# EAGLE design mainboard (EAGLE 8.0.2)
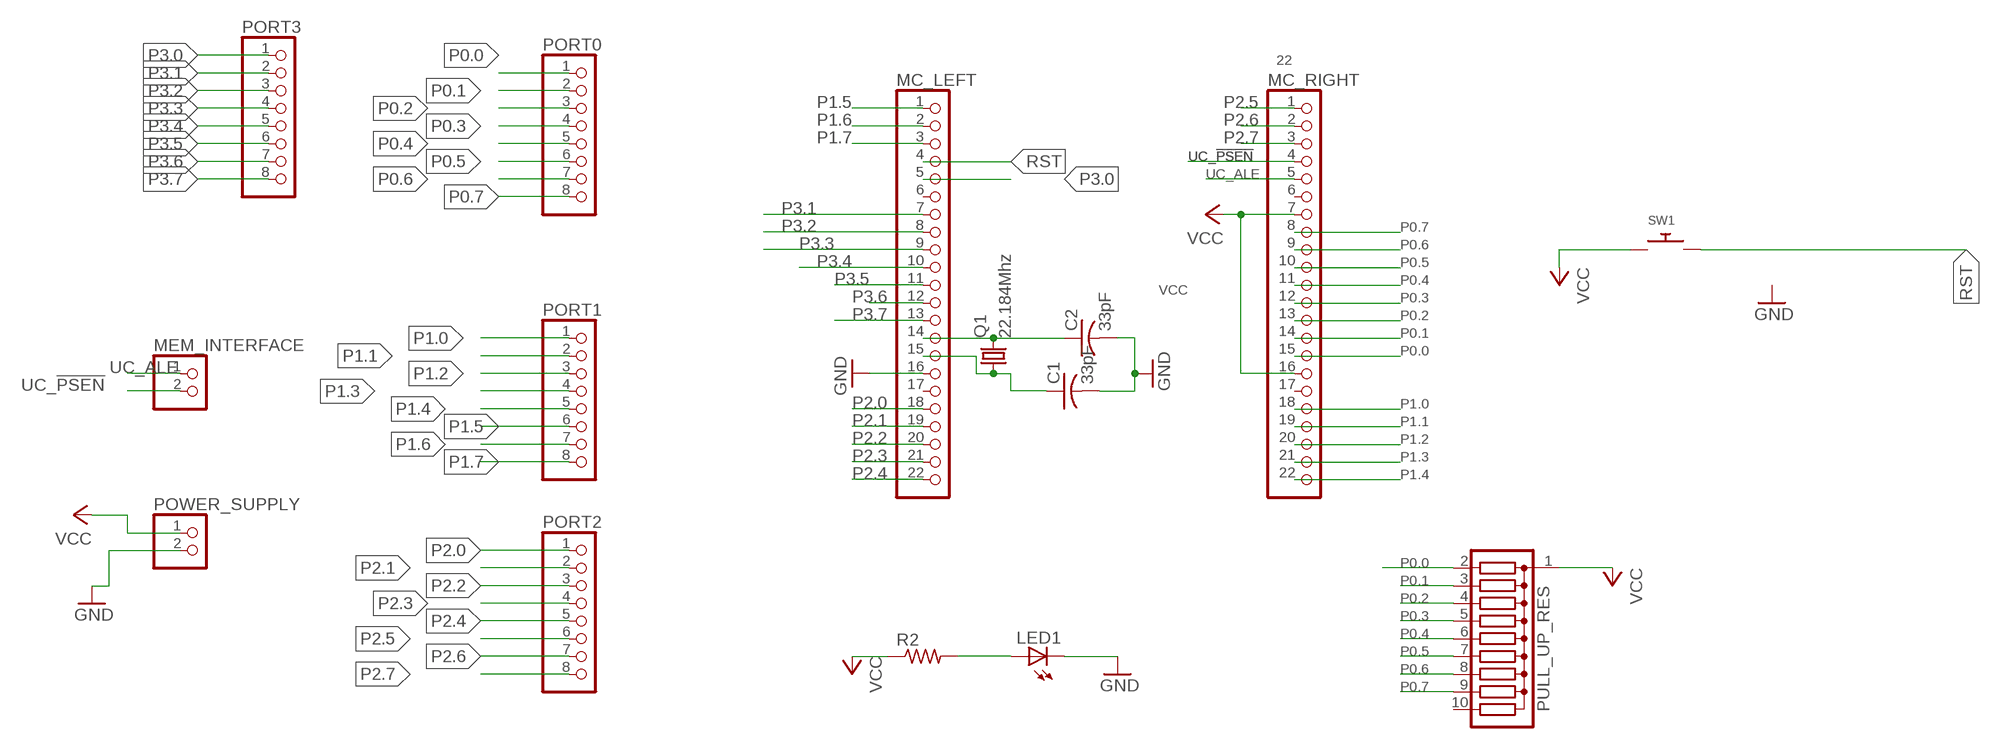
[diagram p0: schematic, sheet 1]

## Parts
C1  33pF  C-US050-025X075  [C050-025X075]
C2  33pF  C-US050-025X075  [C050-025X075]
LED1  LED3MM  [LED3MM]
MC_LEFT  PINHD-1X22  [1X22]
MC_RIGHT  PINHD-1X22  [1X22]
MEM_INTERFACE  PINHD-1X2  [1X02]
PORT0  PINHD-1X8  [1X08]
PORT1  PINHD-1X8  [1X08]
PORT2  PINHD-1X8  [1X08]
PORT3  PINHD-1X8  [1X08]
POWER_SUPPLY  PINHD-1X2  [1X02]
PULL_UP_RES  G09R  [SIL10]
Q1  22.184Mhz  CRYSTALHC49S  [HC49/S]
R2  R-US_0204/5  [0204/5]
SW1  SWITCH_PUSHBUTTONEVQ-PE  [TACT_PANA-EVQ]

## Nets
GND: C1.2 C2.2 LED1.K(C) MC_LEFT.16 POWER_SUPPLY.2
N$1: C2.1 MC_LEFT.14 Q1.2
N$2: C1.1 MC_LEFT.15 Q1.1
N$12: LED1.A R2.2
P0.0: MC_RIGHT.15 PORT0.1 PULL_UP_RES.2
P0.1: MC_RIGHT.14 PORT0.2 PULL_UP_RES.3
P0.2: MC_RIGHT.13 PORT0.3 PULL_UP_RES.4
P0.3: MC_RIGHT.12 PORT0.4 PULL_UP_RES.5
P0.4: MC_RIGHT.11 PORT0.5 PULL_UP_RES.6
P0.5: MC_RIGHT.10 PORT0.6 PULL_UP_RES.7
P0.6: MC_RIGHT.9 PORT0.7 PULL_UP_RES.8
P0.7: MC_RIGHT.8 PORT0.8 PULL_UP_RES.9
P1.0: MC_RIGHT.18 PORT1.1
P1.1: MC_RIGHT.19 PORT1.2
P1.2: MC_RIGHT.20 PORT1.3
P1.3: MC_RIGHT.21 PORT1.4
P1.4: MC_RIGHT.22 PORT1.5
P1.5: MC_LEFT.1 PORT1.6
P1.6: MC_LEFT.2 PORT1.7
P1.7: MC_LEFT.3 PORT1.8
P2.0: MC_LEFT.18 PORT2.1
P2.1: MC_LEFT.19 PORT2.2
P2.2: MC_LEFT.20 PORT2.3
P2.3: MC_LEFT.21 PORT2.4
P2.4: MC_LEFT.22 PORT2.5
P2.5: MC_RIGHT.1 PORT2.6
P2.6: MC_RIGHT.2 PORT2.7
P2.7: MC_RIGHT.3 PORT2.8
P3.0: MC_LEFT.5 PORT3.1
P3.1: MC_LEFT.7 PORT3.2
P3.2: MC_LEFT.8 PORT3.3
P3.3: MC_LEFT.9 PORT3.4
P3.4: MC_LEFT.10 PORT3.5
P3.5: MC_LEFT.11 PORT3.6
P3.6: MC_LEFT.12 PORT3.7
P3.7: MC_LEFT.13 PORT3.8
RST: MC_LEFT.4 SW1.P$2
UC_!PSEN: MC_RIGHT.4 MEM_INTERFACE.2
UC_ALE: MC_RIGHT.5 MEM_INTERFACE.1
VCC: MC_RIGHT.7 MC_RIGHT.16 POWER_SUPPLY.1 PULL_UP_RES.1 R2.1 SW1.P$1
Unconnected: MC_LEFT.6 MC_LEFT.17 MC_RIGHT.6 MC_RIGHT.17 PULL_UP_RES.10

## Notes on the sheet
- 22

## Library data of the parts
C1 C2 = adafruit:C-US: CAPACITOR, American symbol
LED1 = adafruit:LED: LED OSRAM: - CHIPLED LG R971, LG N971, LY N971, LG Q971, LY Q971, LO R971, LY R971 LH N974, LH R974 LS Q976, LO Q976, LY Q976 LO Q996 - Hyper CHIPLED LW Q18S LB Q993, LB Q99A, LB R99A - SideLED LS A670, LO A670, LY A670, LG A670, LP A670 LB A673, LV A673, LT A673, LW A673 LH A674 LY A675 LS A676, LA A676, LO A676, LY A676, LW A676 LS A679, LY A679, LG A679 - Hyper Micro SIDELED® LS Y876, LA Y876, LO Y876, LY Y876 LT Y87S - SmartLED LW L88C, LW L88S LB L89C, LB L89S, LG L890 LS L89K, LO L89K, LY L89K LS L896, LA L896, LO L896, LY L896 - TOPLED LS T670, LO T670, LY T670, LG T670, LP T670 LSG T670, LSP T670, LSY T670, LOP T670, LYG T670 LG T671, LOG T671, LSG T671 LB T673, LV T673, LT T673, LW T673 LH T674 LS T676, LA T676, LO T676, LY T676, LB T676, LH T676, LSB T676, LW T676 LB T67C, LV T67C, LT T67C, LS T67K, LO T67K, LY T67K, LW E67C LS E67B, LA E67B, LO E67B, LY E67B, LB E67C, LV E67C, LT E67C LW T67C LS T679, LY T679, LG T679 LS T770, LO T770, LY T770, LG T770, LP T770 LB T773, LV T773, LT T773, LW T773 LH T774 LS E675, LA E675, LY E675, LS T675 LS T776, LA T776, LO T776, LY T776, LB T776 LHGB T686 LT T68C, LB T68C - Hyper Mini TOPLED® LB M676 - Mini TOPLED Santana® LG M470 LS M47K, LO M47K, LY M47K Source: http://www.osram.convergy.de/
MC_LEFT MC_RIGHT = pinhead:PINHD-1X22: PIN HEADER
MEM_INTERFACE POWER_SUPPLY = pinhead:PINHD-1X2: PIN HEADER
PORT0 PORT1-PORT3 = pinhead:PINHD-1X8: PIN HEADER
PULL_UP_RES = resistor-sil:G09R: SIL RESISTOR; OC_FARNELL: unknown; OC_NEWARK: unknown
Q1 = adafruit:CRYSTAL: CRYSTAL; OC_FARNELL: 1667008; OC_NEWARK: unknown
R2 = adafruit:R-US_: RESISTOR, American symbol
SW1 = adafruit:SWITCH_PUSHBUTTON: Buttons SOFTTOUCHSMD_SJ - Soft touch temporary push button (Super Junk Akihabara) Compatible with SKPMANE010 [Mouser: 688-SKPMAN] C&K_KSS = Digikey: KSS221GLFS

## Board
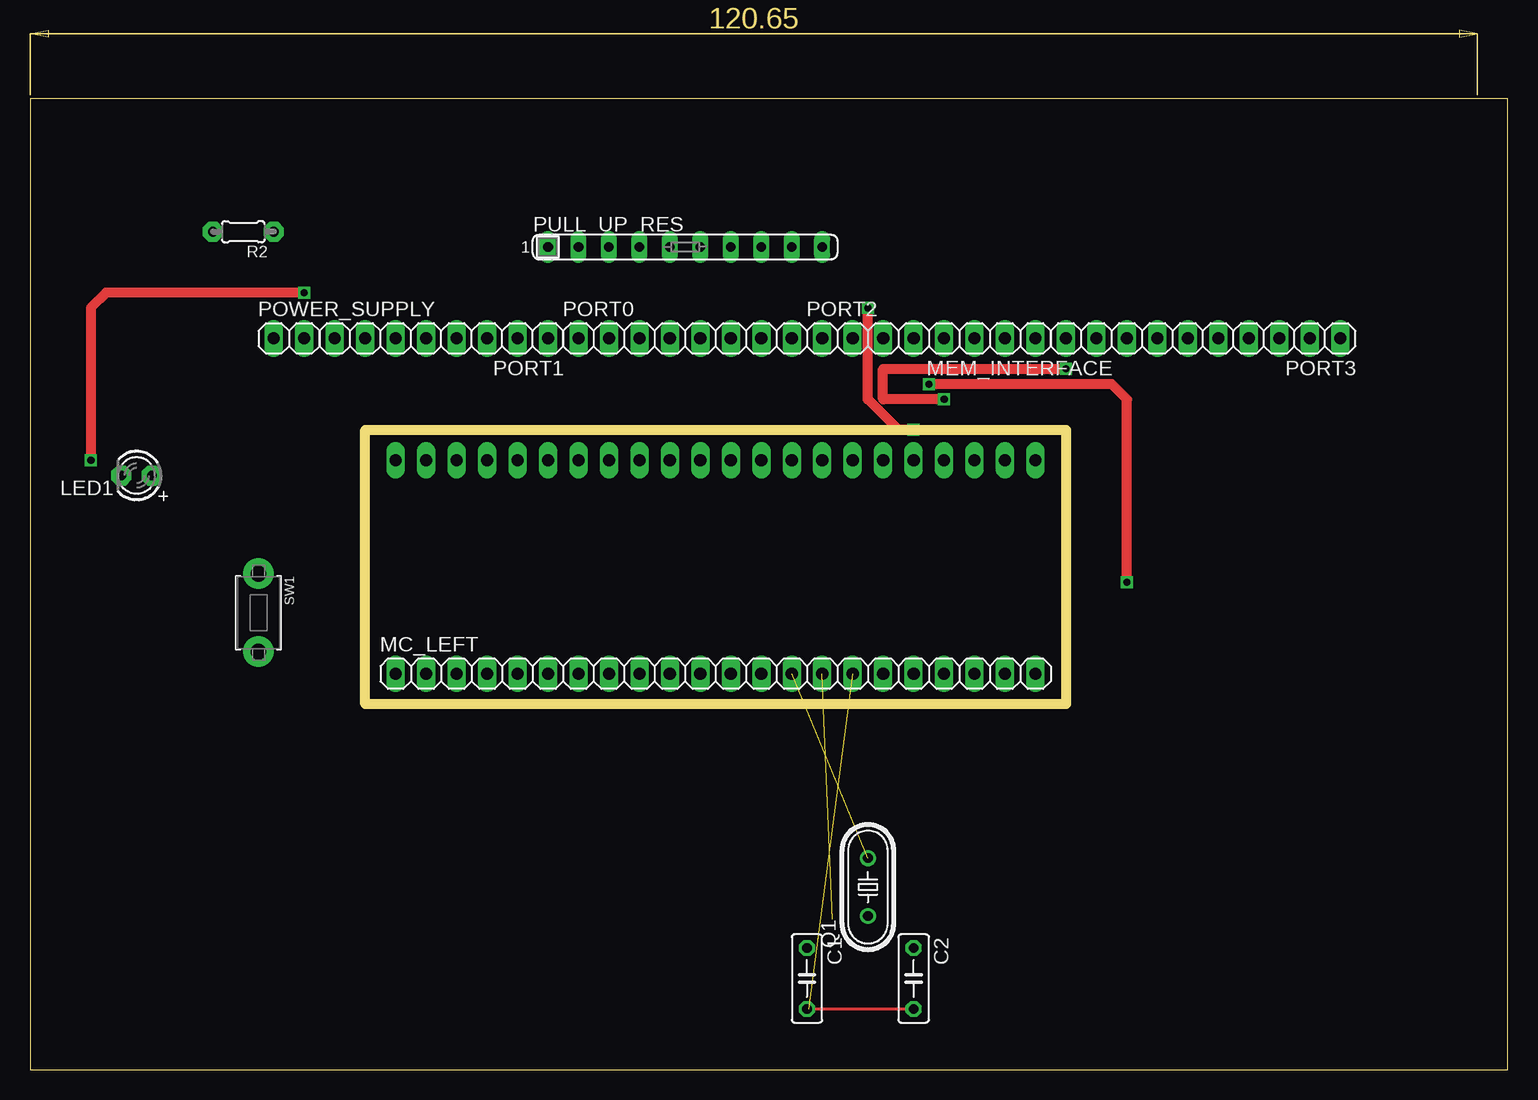
[diagram p1: board, top side]
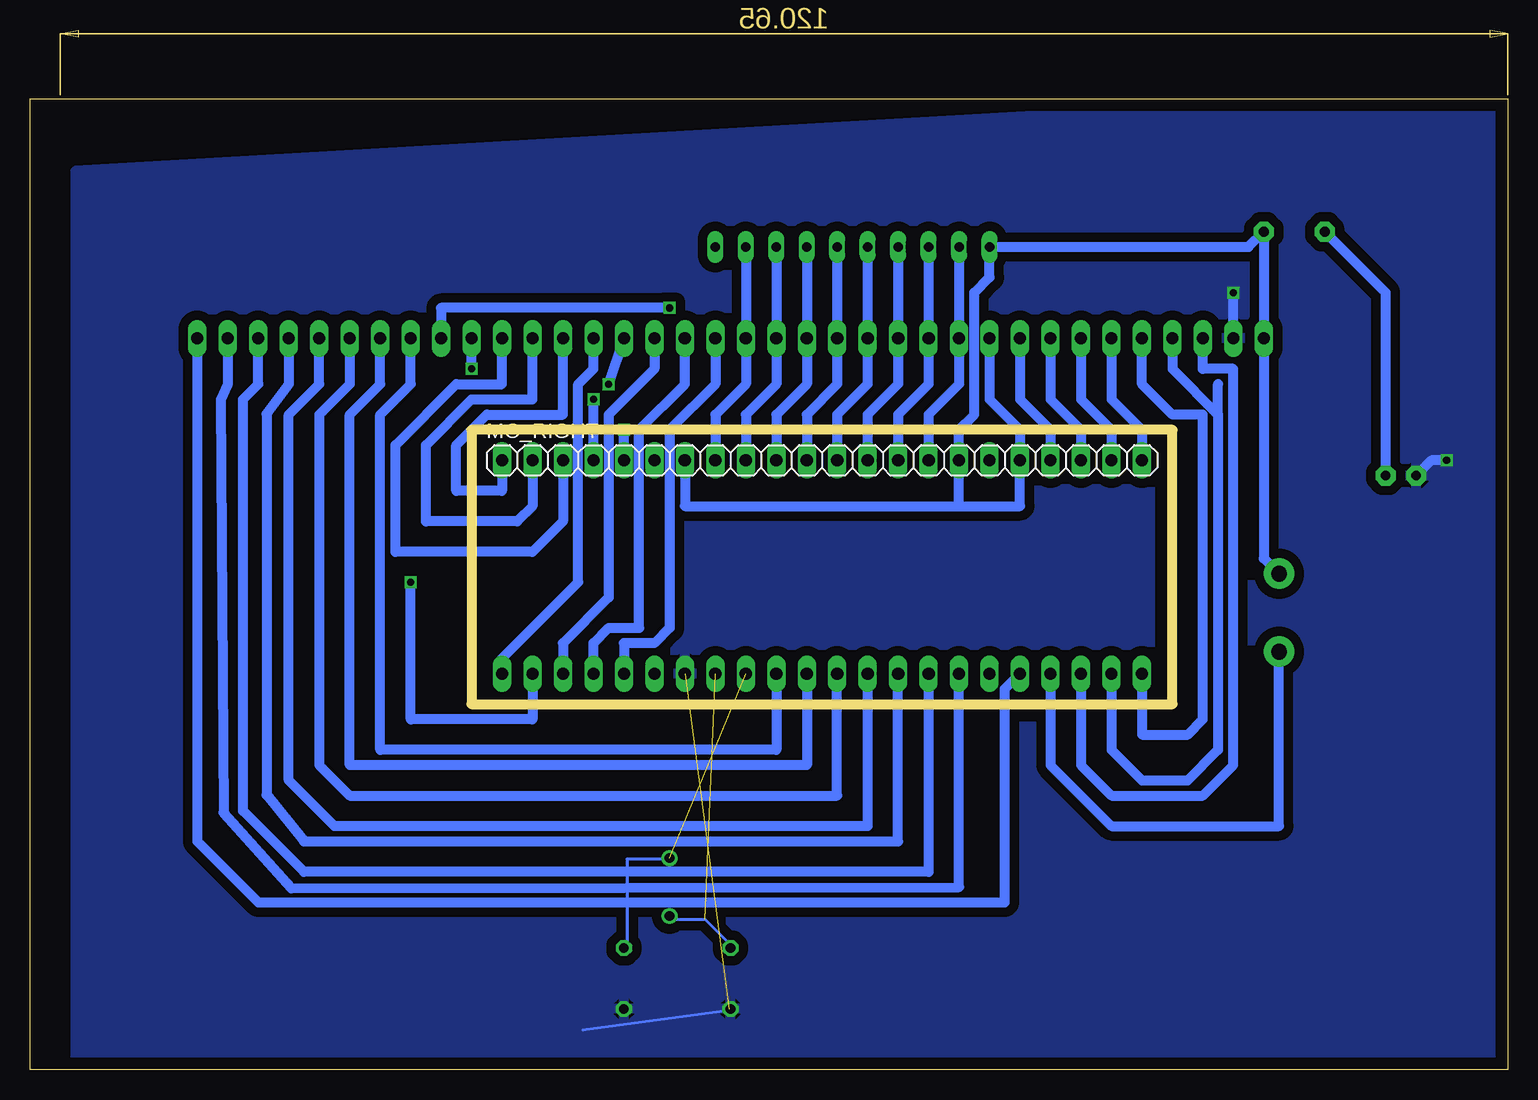
[diagram p2: board, bottom side, seen from below]

Size 123.17 x 80.95 mm. Coordinates in mm from the lower left corner, seen from the top.
Outline: 0,0 123.17,0 123.17,80.95 0,80.95 0,0
Outline: 27.94,53.34 86.36,53.34 86.36,30.48 27.94,30.48 27.94,53.34
Copper layers (1*16): Top 0.035mm / dielectric 1.5mm / Bottom 0.035mm
Design rules "default *": minimum track width 10mil, minimum drill 24mil, track to track 0.8mm, track to pad 1mm, pad to pad 8mil, via to via 8mil, smd to smd 8mil, copper to edge 40mil, drill to drill 8mil, minimum pad ring 10mil, minimum via ring 8mil, stop-mask expansion 4mil, vias tented up to drill 0mil, thermal gap 10mil

### Footprints (pad centres in the part's own frame; a part is rotated, then mirrored left to right if it is on the bottom)
C050-025X075 = drill 0.813 octagon: 1 -2.54,0; 2 2.54,0
LED3MM = drill 0.813 pad 1.676 octagon: A -1.27,0; K 1.27,0
1X22 = drill 1.016 long: 1 -26.67,0; 2 -24.13,0; 3 -21.59,0; 4 -19.05,0; 5 -16.51,0; 6 -13.97,0; 7 -11.43,0; 8 -8.89,0; 9 -6.35,0; 10 -3.81,0; 11 -1.27,0; 12 1.27,0; 13 3.81,0; 14 6.35,0; 15 8.89,0; 16 11.43,0; 17 13.97,0; 18 16.51,0; 19 19.05,0; 20 21.59,0; 21 24.13,0; 22 26.67,0
1X02 = drill 1.016 long: 1 -1.27,0; 2 1.27,0
1X08 = drill 1.016 long: 1 -8.89,0; 2 -6.35,0; 3 -3.81,0; 4 -1.27,0; 5 1.27,0; 6 3.81,0; 7 6.35,0; 8 8.89,0
SIL10 = drill 0.813 long: 1 -11.43,0; 2 -8.89,0; 3 -6.35,0; 4 -3.81,0; 5 -1.27,0; 6 1.27,0; 7 3.81,0; 8 6.35,0; 9 8.89,0; 10 11.43,0
HC49/S = drill 0.813: 1 -2.413,0; 2 2.413,0
0204/5 = drill 0.813 pad 1.676 octagon: 1 -2.54,0; 2 2.54,0
TACT_PANA-EVQ = drill 1.3 pad 2.54: P$1 -3.25,0; P$2 3.25,0

### Placement (x,y rotation side)
C1  64.77,7.62 270 top
C2  73.66,7.62 270 top
LED1  8.89,49.53 180 top
MC_LEFT  57.15,33.02 0 top
MC_RIGHT  57.15,50.8 0 bottom
MEM_INTERFACE  87.63,60.96 180 top
PORT0  54.61,60.96 0 top
PORT1  34.29,60.96 180 top
PORT2  74.93,60.96 0 top
PORT3  100.33,60.96 180 top
POWER_SUPPLY  21.59,60.96 0 top
PULL_UP_RES  54.61,68.58 0 top
Q1  69.85,15.24 90 top
R2  17.78,69.85 180 top
SW1  19.05,38.1 270 top

### Tracks (layer width: path | path; a pad name or v marks a point on that pad's centre or on a via)
GND  (via drill 0.6)  (1 unrouted)
  Top 0.254: C1.2 64.9,5.06 73.4,5.06 C2.2
  Top 0.813: v22.86,64.77 6.35,64.77 5.08,63.5 v5.08,50.8
  Bottom 0.254: 77.1,3.33 64.4,5.06 C1.2
  Bottom 0.813: POWER_SUPPLY.2 v22.86,64.77 | v5.08,50.8 6.35,50.8 LED1.K
  pour Bottom: 119.38,74.93 119.38,-3.81 -6.35,-3.81 -6.35,81.28 8.89,81.28
N$1  (1 unrouted)
  Bottom 0.254: C2.1 73.4,10.56 73.4,17.56 69.9,17.56 Q1.2
N$2  (1 unrouted)
  Bottom 0.254: C1.1 64.9,10.56 66.9,12.56 69.4,12.56 Q1.1
N$12
  Bottom 0.813: LED1.A 10.16,64.77 R2.2
P0.0
  Bottom 0.813: MC_RIGHT.15 48.26,54.61 45.72,57.15 PORT0.1 PULL_UP_RES.2
P0.1
  Bottom 0.813: MC_RIGHT.14 50.8,54.61 48.26,57.15 PORT0.2 PULL_UP_RES.3
P0.2
  Bottom 0.813: MC_RIGHT.13 53.34,54.61 50.8,57.15 PORT0.3 PULL_UP_RES.4
P0.3
  Bottom 0.813: MC_RIGHT.12 55.88,54.61 53.34,57.15 PORT0.4 PULL_UP_RES.5
P0.4
  Bottom 0.813: MC_RIGHT.11 58.42,54.61 55.88,57.15 PORT0.5 PULL_UP_RES.6
P0.5
  Bottom 0.813: MC_RIGHT.10 60.96,54.61 58.42,57.15 PORT0.6 PULL_UP_RES.7
P0.6
  Bottom 0.813: MC_RIGHT.9 63.5,54.61 60.96,57.15 PORT0.7 PULL_UP_RES.8
P0.7
  Bottom 0.813: MC_RIGHT.8 66.04,54.61 63.5,57.15 PORT0.8 PULL_UP_RES.9
P1.0
  Bottom 0.813: PORT1.1 43.18,55.88 40.64,53.34 MC_RIGHT.18
P1.1
  Bottom 0.813: PORT1.2 40.64,55.88 38.1,53.34 MC_RIGHT.19
P1.2
  Bottom 0.813: PORT1.3 38.1,55.88 35.56,53.34 MC_RIGHT.20
P1.3
  Bottom 0.813: PORT1.4 35.56,55.88 33.02,53.34 MC_RIGHT.21
P1.4
  Bottom 0.813: PORT1.5 33.02,55.88 30.48,53.34 MC_RIGHT.22
P1.5
  Bottom 0.813: MC_LEFT.1 30.48,27.94 26.67,27.94 25.4,29.21 25.4,54.61 27.94,54.61 30.48,57.15 PORT1.6
P1.6
  Bottom 0.813: MC_LEFT.2 33.02,26.67 30.48,24.13 26.67,24.13 24.13,26.67 24.13,54.61 | 24.13,54.61 24.13,57.15 | PORT1.7 27.94,58.42 24.13,54.61
P1.7
  Bottom 0.813: MC_LEFT.3 35.56,25.4 33.02,22.86 25.4,22.86 22.86,25.4 22.86,58.42 25.4,58.42 PORT1.8
P2.0
  Bottom 0.813: PORT2.1 66.04,57.15 69.85,53.34 69.85,36.83 71.12,35.56 73.66,35.56 MC_LEFT.18
P2.1
  Bottom 0.813: MC_LEFT.19 76.2,35.56 74.93,36.83 72.39,36.83 72.39,53.34 68.58,57.15 PORT2.2
P2.2
  Bottom 0.813: PORT2.3 71.12,58.42 74.93,54.61 74.93,39.37 78.74,35.56 MC_LEFT.20
P2.3  (via drill 0.6)
  Top 0.813: v91.44,40.64 91.44,55.88 90.17,57.15 v74.93,57.15
  Bottom 0.813: MC_LEFT.21 81.28,29.21 91.44,29.21 v91.44,40.64 | v74.93,57.15 PORT2.4
P2.4
  Bottom 0.813: MC_LEFT.22 83.82,34.29 77.47,40.64 77.47,57.15 76.2,58.42 PORT2.5
P2.5
  Bottom 0.813: MC_RIGHT.1 83.82,48.26 87.63,48.26 87.63,52.07 85.09,54.61 78.74,54.61 PORT2.6
P2.6
  Bottom 0.813: MC_RIGHT.2 81.28,46.99 82.55,45.72 90.17,45.72 90.17,52.07 86.36,55.88 81.28,55.88 PORT2.7
P2.7
  Bottom 0.813: MC_RIGHT.3 78.74,45.72 81.28,43.18 92.71,43.18 92.71,52.07 87.63,57.15 83.82,57.15 PORT2.8
P3.0
  Bottom 0.813: PORT3.1 109.22,19.05 104.14,13.97 41.91,13.97 41.91,31.75 MC_LEFT.5
P3.1
  Bottom 0.813: PORT3.2 106.68,57.15 107.26,55.85 107.03,21.45 101.37,15.12 45.72,15.24 MC_LEFT.7
P3.2
  Bottom 0.813: MC_LEFT.8 48.26,16.51 100.33,16.51 105.41,21.59 105.41,55.88 104.14,57.15 PORT3.3
P3.3
  Bottom 0.813: MC_LEFT.9 50.8,19.05 100.33,19.05 103.45,22.92 103.45,54.67 101.6,57.15 PORT3.4
P3.4
  Bottom 0.813: MC_LEFT.10 53.34,20.32 97.79,20.32 101.6,24.13 101.6,54.61 99.06,57.15 PORT3.5
P3.5
  Bottom 0.813: PORT3.6 96.52,57.15 99.06,54.61 99.06,25.4 96.52,22.86 55.88,22.86 MC_LEFT.11
P3.6
  Bottom 0.813: MC_LEFT.12 58.42,25.4 96.52,25.4 96.52,54.61 93.98,57.15 PORT3.7
P3.7
  Bottom 0.813: MC_LEFT.13 60.96,26.67 93.98,26.67 93.98,54.61 91.44,57.15 PORT3.8
RST
  Bottom 0.813: MC_LEFT.4 38.1,25.4 33.02,20.32 19.05,20.32 SW1.P$2
UC_!PSEN  (via drill 0.6)
  Top 0.813: v76.2,55.88 71.12,55.88 71.12,58.42 v86.36,58.42
  Bottom 0.813: MC_RIGHT.4 v76.2,55.88 | v86.36,58.42 MEM_INTERFACE.2
UC_ALE  (via drill 0.6)
  Top 0.813: v73.66,53.34 72.39,53.34 69.85,55.88 v69.85,63.5
  Bottom 0.813: MC_RIGHT.5 v73.66,53.34 | v69.85,63.5 88.9,63.5 MEM_INTERFACE.1
VCC
  Bottom 0.813: MC_RIGHT.7 68.58,46.99 45.72,46.99 | 45.72,46.99 MC_RIGHT.16 45.72,53.34 44.45,54.61 44.45,64.77 43.18,66.04 PULL_UP_RES.1 21.59,68.58 R2.1 POWER_SUPPLY.1 20.32,42.62 SW1.P$1 | 45.72,46.99 40.64,46.99 40.64,50.8